# EAGLE design RPi_Extension_breakout (EAGLE 7.6.0)
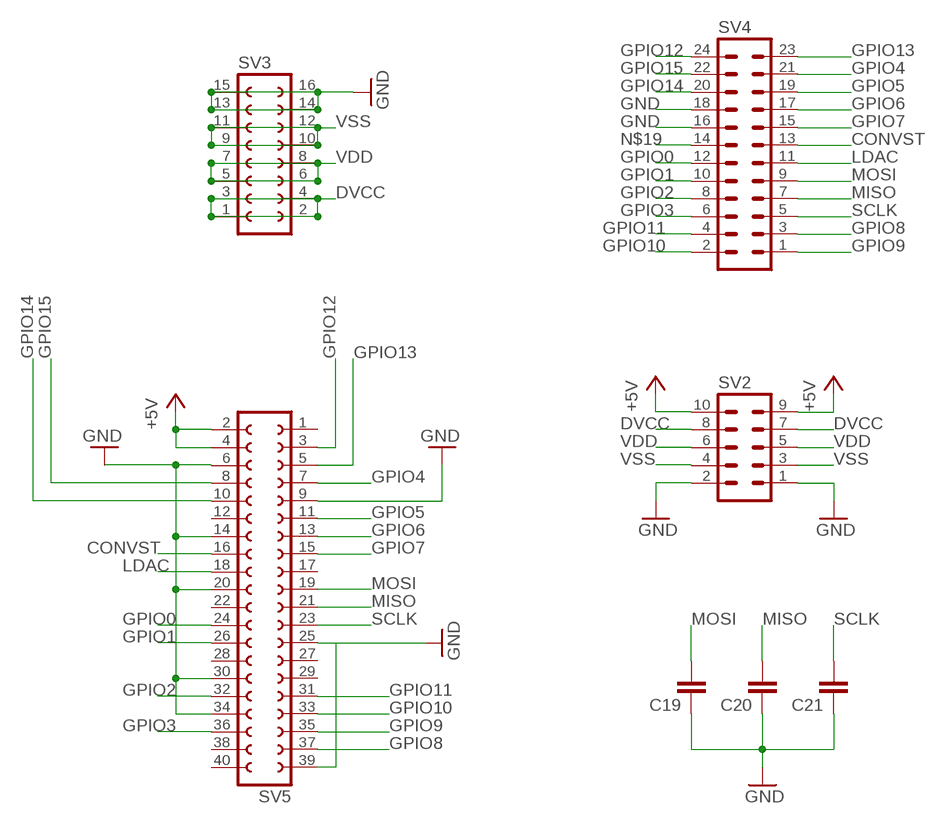
[diagram p0: schematic, sheet 1]

## Parts
C19  C-EUC0603  [C0603]
C20  C-EUC0603  [C0603]
C21  C-EUC0603  [C0603]
SV2  MA05-2  [MA05-2]
SV3  FE08-2  [FE08-2]
SV4  MA12-2  [MA12-2]
SV5  FE20-2  [FE20-2]

## Nets
+5V: SV2.9 SV2.10 SV5.2 SV5.4
CONVST: SV4.13 SV5.16
DVCC: SV2.7 SV2.8 SV3.1 SV3.2 SV3.3 SV3.4
GND: C19.1 C20.1 C21.1 SV2.1 SV2.2 SV3.13 SV3.14 SV3.15 SV3.16 SV4.16 SV4.18 SV5.6 SV5.9 SV5.14 SV5.20 SV5.25 SV5.30 SV5.34 SV5.39
GPIO0: SV4.12 SV5.24
GPIO1: SV4.10 SV5.26
GPIO2: SV4.8 SV5.32
GPIO3: SV4.6 SV5.36
GPIO4: SV4.21 SV5.7
GPIO5: SV4.19 SV5.11
GPIO6: SV4.17 SV5.13
GPIO7: SV4.15 SV5.15
GPIO8: SV4.3 SV5.37
GPIO9: SV4.1 SV5.35
GPIO10: SV4.2 SV5.33
GPIO11: SV4.4 SV5.31
GPIO12: SV4.24 SV5.3
GPIO13: SV4.23 SV5.5
GPIO14: SV4.20 SV5.10
GPIO15: SV4.22 SV5.8
LDAC: SV4.11 SV5.18
MISO: C20.2 SV4.7 SV5.21
MOSI: C19.2 SV4.9 SV5.19
N$19: SV4.14
SCLK: C21.2 SV4.5 SV5.23
VDD: SV2.5 SV2.6 SV3.5 SV3.6 SV3.7 SV3.8
VSS: SV2.3 SV2.4 SV3.9 SV3.10 SV3.11 SV3.12
Unconnected: SV5.1 SV5.12 SV5.17 SV5.22 SV5.27 SV5.28 SV5.29 SV5.38 SV5.40

## Library data of the parts
C19-C21 = rcl:C-EU: CAPACITOR, European symbol
SV2 = con-lstb:MA05-2: PIN HEADER; OC_FARNELL: unknown; OC_NEWARK: unknown
SV3 = con-lsta:FE08-2: FEMALE HEADER; OC_FARNELL: unknown; OC_NEWARK: unknown
SV4 = con-lstb:MA12-2: PIN HEADER; OC_FARNELL: unknown; OC_NEWARK: unknown
SV5 = con-lsta:FE20-2: FEMALE HEADER; OC_FARNELL: unknown; OC_NEWARK: unknown

## Board
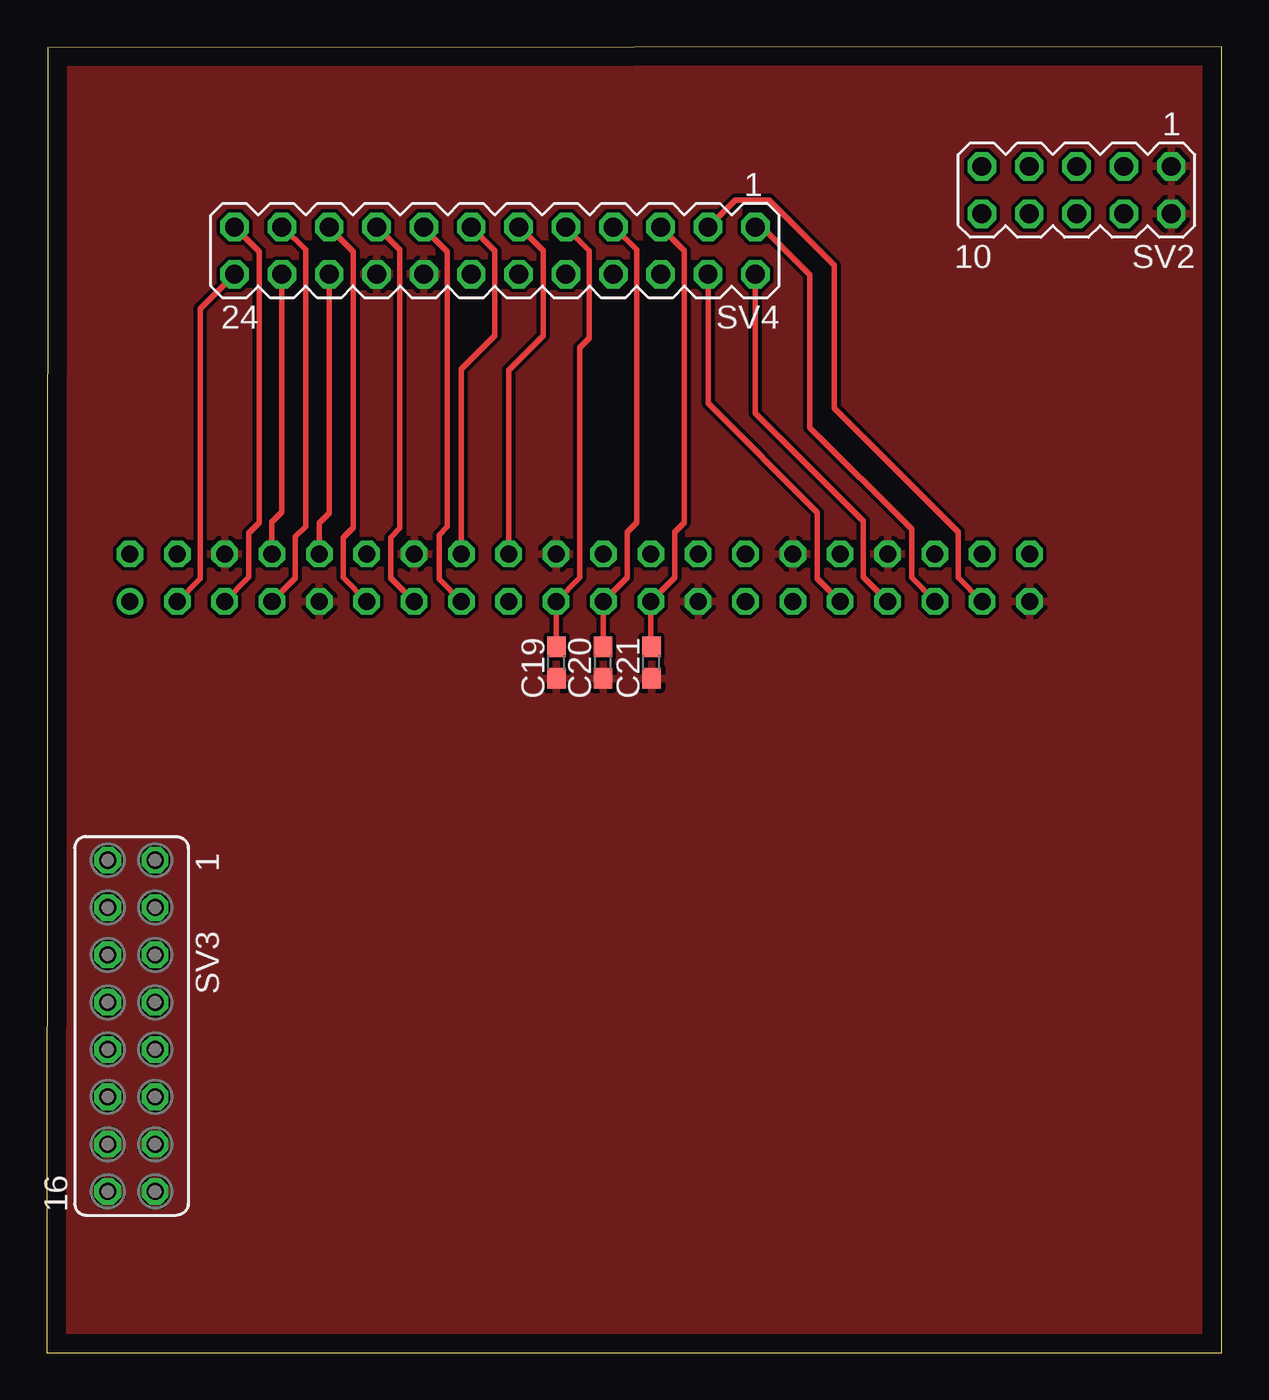
[diagram p1: board, top side]
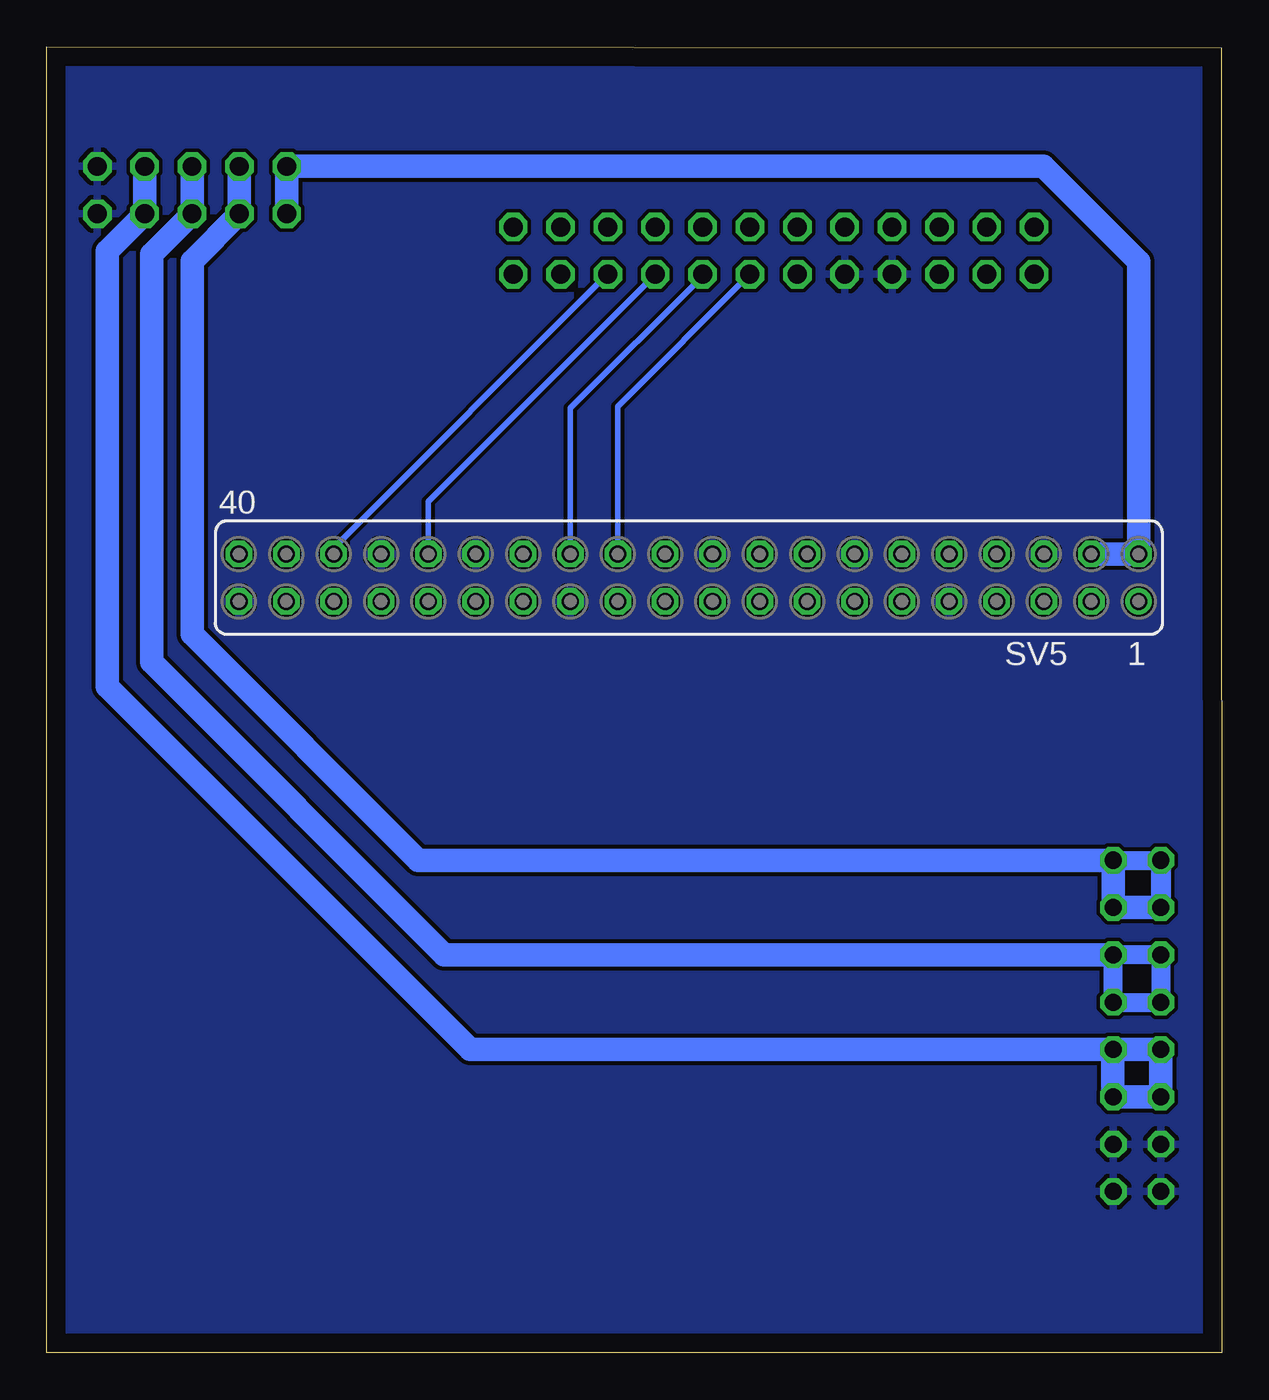
[diagram p2: board, bottom side, seen from below]

Size 63.05 x 70.1 mm. Coordinates in mm from the lower left corner, seen from the top.
Outline: 0,0 63.05,0 63.05,70.1 0.05,70.05 0,0
Copper layers (1*16): Top 0.035mm / dielectric 1.5mm / Bottom 0.035mm
Design rules "default": minimum track width 10mil, minimum drill 24mil, track to track 8mil, track to pad 8mil, pad to pad 8mil, via to via 8mil, smd to smd 8mil, copper to edge 40mil, drill to drill 8mil, minimum pad ring 10mil, minimum via ring 8mil, stop-mask expansion 4mil, vias tented up to drill 0mil, thermal gap 10mil

### Footprints (pad centres in the part's own frame; a part is rotated, then mirrored left to right if it is on the bottom)
C0603 = smd 1.1 x 1: 1 -0.85,0; 2 0.85,0
MA05-2 = drill 1.016 octagon: 1 -5.08,-1.27; 2 -5.08,1.27; 3 -2.54,-1.27; 4 -2.54,1.27; 5 0,-1.27; 6 0,1.27; 7 2.54,-1.27; 8 2.54,1.27; 9 5.08,-1.27; 10 5.08,1.27
FE08-2 = drill 0.914 octagon: 1 -8.89,1.27; 2 -8.89,-1.27; 3 -6.35,1.27; 4 -6.35,-1.27; 5 -3.81,1.27; 6 -3.81,-1.27; 7 -1.27,1.27; 8 -1.27,-1.27; 9 1.27,1.27; 10 1.27,-1.27; 11 3.81,1.27; 12 3.81,-1.27; 13 6.35,1.27; 14 6.35,-1.27; 15 8.89,1.27; 16 8.89,-1.27
MA12-2 = drill 1.016 octagon: 1 -13.97,-1.27; 2 -13.97,1.27; 3 -11.43,-1.27; 4 -11.43,1.27; 5 -8.89,-1.27; 6 -8.89,1.27; 7 -6.35,-1.27; 8 -6.35,1.27; 9 -3.81,-1.27; 10 -3.81,1.27; 11 -1.27,-1.27; 12 -1.27,1.27; 13 1.27,-1.27; 14 1.27,1.27; 15 3.81,-1.27; 16 3.81,1.27; 17 6.35,-1.27; 18 6.35,1.27; 19 8.89,-1.27; 20 8.89,1.27; 21 11.43,-1.27; 22 11.43,1.27; 23 13.97,-1.27; 24 13.97,1.27
FE20-2 = drill 0.914: 1 -24.13,1.27 | drill 0.914 octagon: 2 -24.13,-1.27; 3 -21.59,1.27; 4 -21.59,-1.27; 5 -19.05,1.27; 6 -19.05,-1.27; 7 -16.51,1.27; 8 -16.51,-1.27; 9 -13.97,1.27; 10 -13.97,-1.27; 11 -11.43,1.27; 12 -11.43,-1.27; 13 -8.89,1.27; 14 -8.89,-1.27; 15 -6.35,1.27; 16 -6.35,-1.27; 17 -3.81,1.27; 18 -3.81,-1.27; 19 -1.27,1.27; 20 -1.27,-1.27; 21 1.27,1.27; 22 1.27,-1.27; 23 3.81,1.27; 24 3.81,-1.27; 25 6.35,1.27; 26 6.35,-1.27; 27 8.89,1.27; 28 8.89,-1.27; 29 11.43,1.27; 30 11.43,-1.27; 31 13.97,1.27; 32 13.97,-1.27; 33 16.51,1.27; 34 16.51,-1.27; 35 19.05,1.27; 36 19.05,-1.27; 37 21.59,1.27; 38 21.59,-1.27; 39 24.13,1.27; 40 24.13,-1.27

### Placement (x,y rotation side)
C19  27.35,37.05 90 top
C20  29.85,37.05 90 top
C21  32.45,37.05 90 top
SV2  55.25,62.4 180 top
SV3  4.55,17.55 270 top
SV4  24.05,59.15 180 top
SV5  28.6,41.6 180 bottom

### Tracks (layer width: path | path; a pad name or v marks a point on that pad's centre or on a via)
+5V
  Bottom 1.27: SV2.10 SV2.9 9.59,63.67 4.47,58.55 SV5.2 SV5.4
CONVST
  Top 0.305: SV4.13 24.05,59.15 24.05,54.6 22.25,52.8 SV5.16
DVCC
  Bottom 1.016: SV3.1 SV3.2 | SV3.2 3.25,26.44 3.25,24.05 3.28,24.05 SV3.2
  Bottom 1.27: SV3.4 SV3.3 SV3.1 43.1,26.44 55.25,38.59 55.25,58.59 SV2.8 SV2.7
GND
  pour Top: -0.65,-0.65 63.7,-0.65 63.7,72.15 -0.65,72.15
  pour Bottom: 0,0 0.65,70.85 63.7,70.85 63.05,0
GPIO0
  Bottom 0.305: SV4.12 32.41,50.79 SV5.24
GPIO1
  Bottom 0.305: SV4.10 27.86,57.79 34.95,50.7 SV5.26
GPIO2
  Bottom 0.305: SV4.8 30.4,57.85 42.57,45.68 SV5.32
GPIO3
  Bottom 0.305: SV4.6 32.97,57.88 47.65,43.2 SV5.36
GPIO4
  Top 0.305: SV4.21 12.68,60.42 13.9,59.2 13.9,44.35 13.35,43.8 13.35,41.59 SV5.7
GPIO5
  Top 0.305: SV4.19 15.16,60.39 16.45,59.1 16.45,44.3 15.9,43.75 15.9,41.6 SV5.11
GPIO6
  Top 0.305: SV4.17 17.73,60.42 18.95,59.2 18.95,44.25 18.45,43.75 18.45,41.59 SV5.13
GPIO7
  Top 0.305: SV4.15 20.24,60.36 21.5,59.1 21.5,44.35 21.05,43.9 21.05,41.53 SV5.15
GPIO8
  Top 0.305: SV4.3 36.93,61.87 38.75,61.87 42.25,58.37 42.25,50.7 48.9,44.05 48.9,41.6 50.17,40.33 SV5.37
GPIO9
  Top 0.305: SV5.35 47.65,40.35 46.4,41.6 46.4,44.2 40.95,49.65 40.95,57.85 38.38,60.42 SV4.1
GPIO10
  Top 0.305: SV4.2 38.02,50.43 43.8,44.65 43.8,41.64 SV5.33
GPIO11
  Top 0.305: SV4.4 35.48,50.97 41.35,45.1 41.35,41.55 SV5.31
GPIO12
  Top 0.305: SV5.3 7.03,40.33 8.25,41.55 8.25,56.05 SV4.24
GPIO13
  Top 0.305: SV4.23 11.4,59.1 11.4,44.55 10.85,44 10.85,41.63 SV5.5
GPIO14
  Top 0.305: SV4.20 15.16,45.06 14.63,44.53 SV5.10
GPIO15
  Top 0.305: SV4.22 12.62,45.12 12.09,44.59 SV5.8
LDAC
  Top 0.305: SV4.11 25.38,60.42 26.65,59.15 26.65,54.6 24.79,52.74 SV5.18
MISO
  Top 0.305: 29.87,37.92 SV5.21 31.15,41.61 31.15,44.05 31.65,44.55 31.65,59.2 30.43,60.42 SV4.7
  Top 0.406: 29.87,37.92 C20.2
MOSI
  Top 0.305: 27.33,37.92 SV5.19 28.6,41.6 28.6,44.2 28.6,53.95 29.1,54.45 29.1,59.15 27.86,60.39 SV4.9
  Top 0.406: 27.33,37.92 C19.2
SCLK
  Top 0.305: 32.41,37.94 SV5.23 33.7,41.62 33.7,44.05 34.2,44.55 34.2,59.15 SV4.5
  Top 0.406: 32.41,37.94 C21.2
VDD
  Bottom 1.016: SV3.7 SV3.8 SV3.6 SV3.5 | SV3.5 5.85,21.36 5.85,18.85 5.82,18.85 SV3.5
  Bottom 1.27: 5.84,18.8 SV3.7 | SV2.5 SV2.6 57.42,58.96 57.42,37.06 41.72,21.36 SV3.5
VSS
  Bottom 0.406: SV3.9 5.85,16.28 | 5.82,13.65 SV3.11
  Bottom 1.27: SV3.9 SV3.10 SV3.12 SV3.11 | 5.85,13.75 5.85,16.28 40.31,16.28 59.8,35.77 59.8,59.12 SV2.4 SV2.3